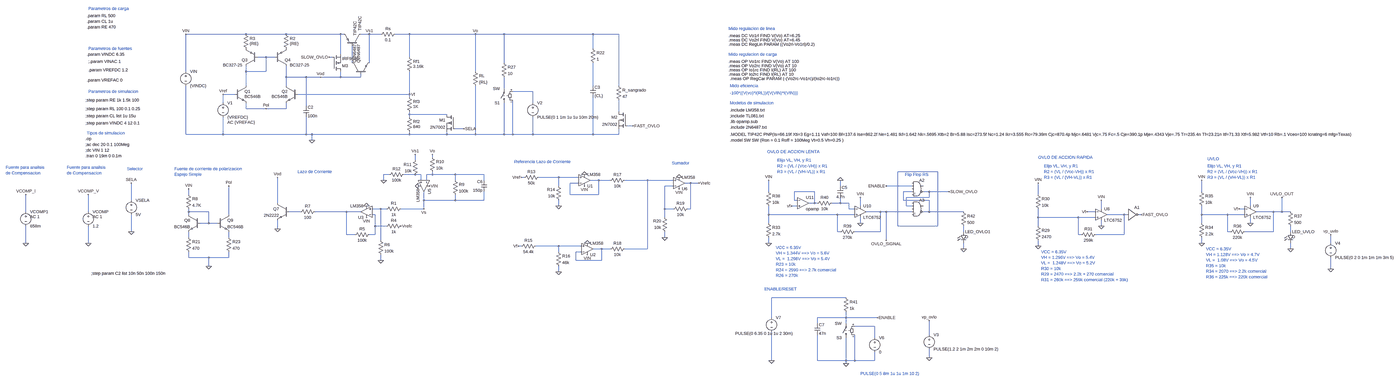
[diagram p0: schematic Regulador_LDOA_v8_uvlo_ovlo.asc, whole sheet]
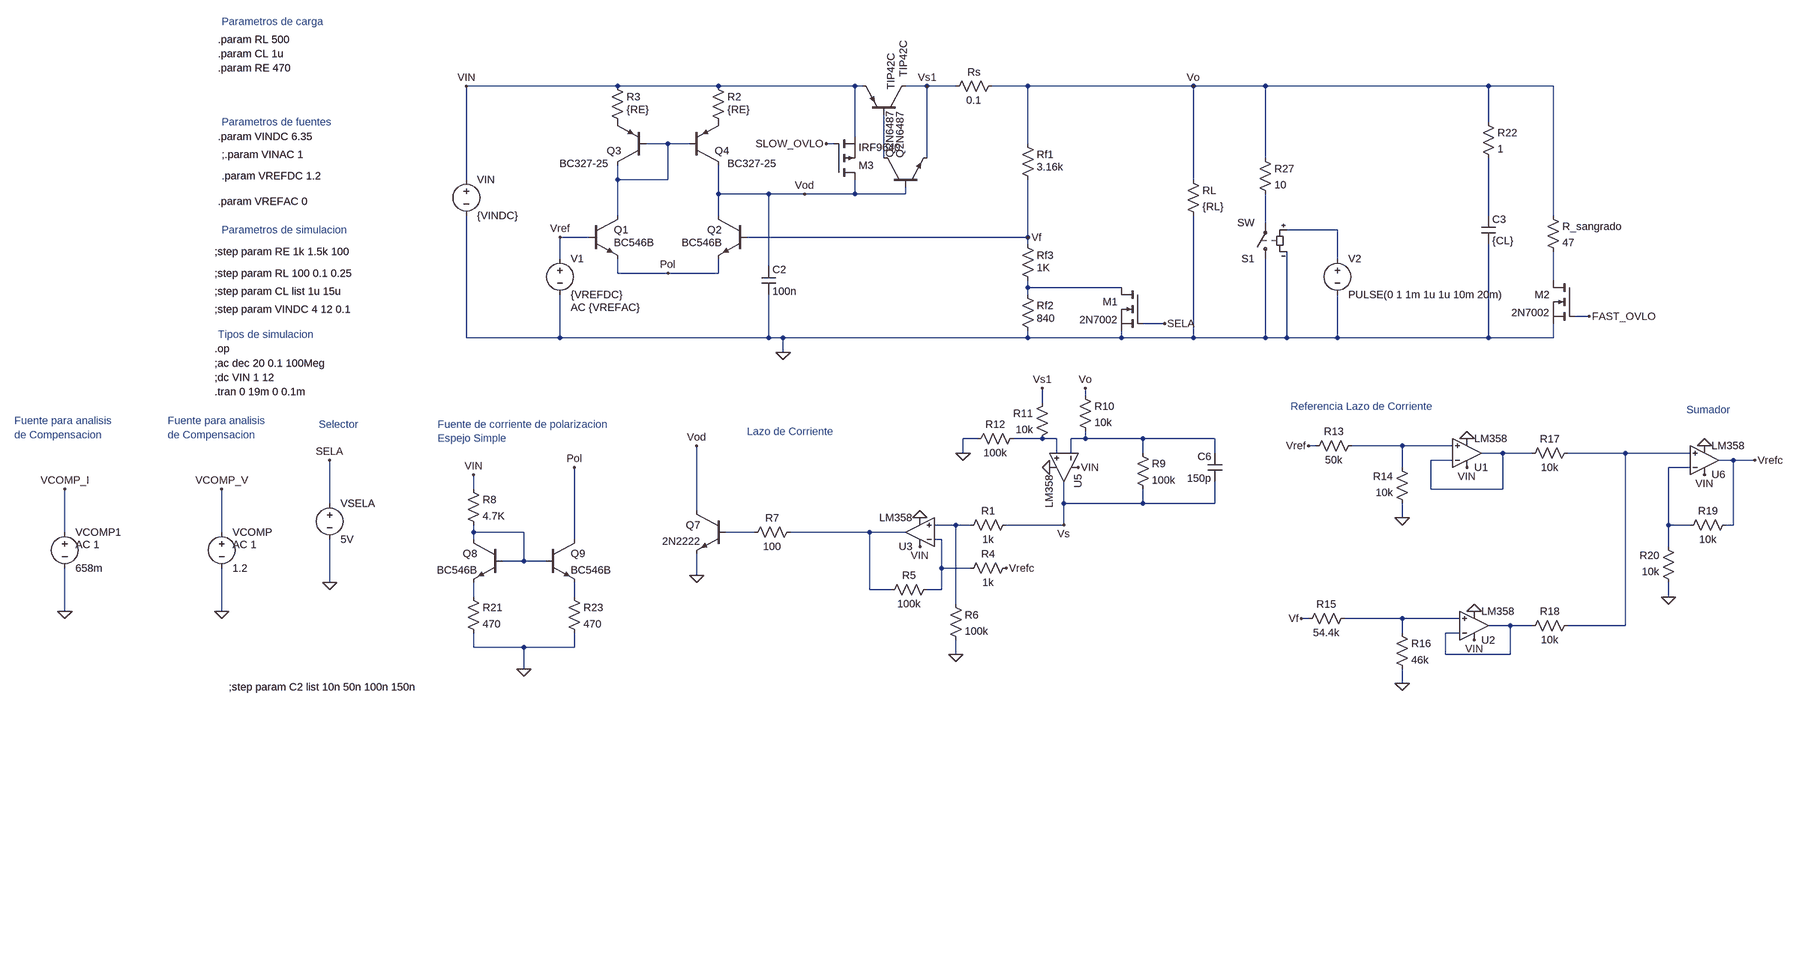
[diagram p1: schematic Regulador_LDOA_v8_uvlo_ovlo.asc, part, row 1 of 1, column 1 of 2]
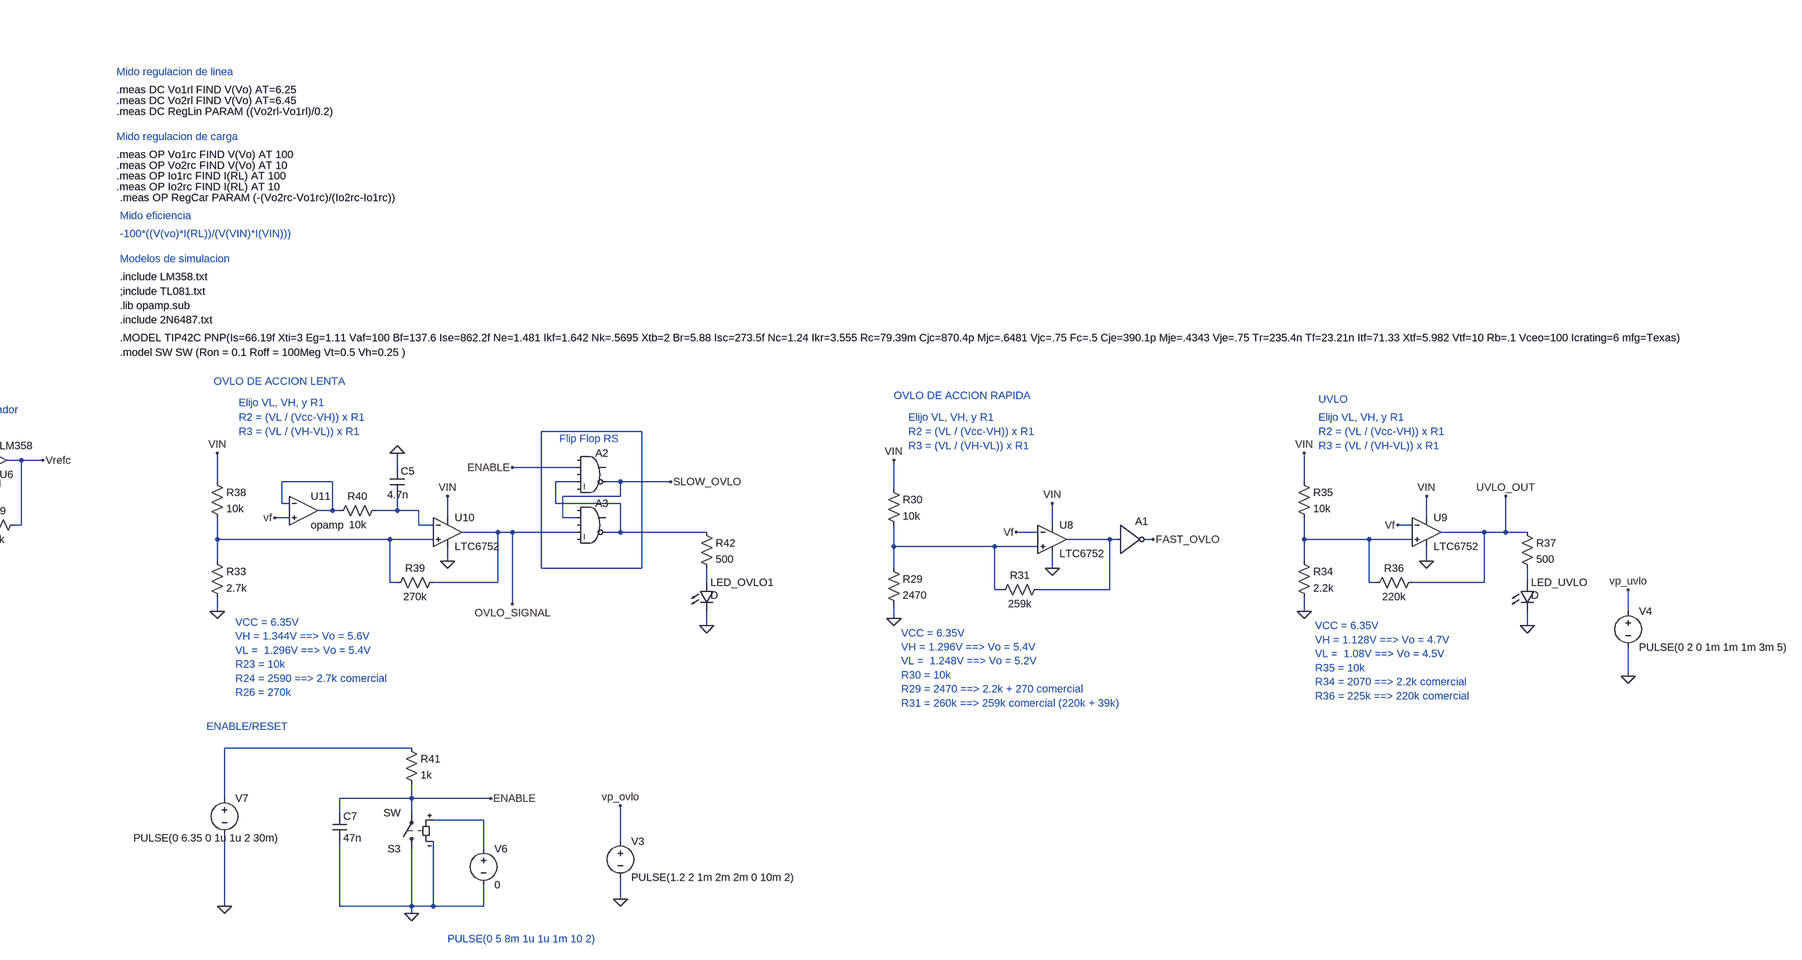
[diagram p2: schematic Regulador_LDOA_v8_uvlo_ovlo.asc, part, row 1 of 1, column 2 of 2]
Regulador_LDOA_v8_uvlo_ovlo.asc, the LTspice schematic file:
Version 4
SHEET 1 2316 856
WIRE -8688 -2384 -9024 -2384
WIRE -8464 -2384 -8688 -2384
WIRE -8160 -2384 -8464 -2384
WIRE -8144 -2384 -8160 -2384
WIRE -8000 -2384 -8048 -2384
WIRE -7936 -2384 -8000 -2384
WIRE -7776 -2384 -7856 -2384
WIRE -7408 -2384 -7776 -2384
WIRE -7248 -2384 -7408 -2384
WIRE -6752 -2384 -7248 -2384
WIRE -6608 -2384 -6752 -2384
WIRE -6752 -2304 -6752 -2384
WIRE -8160 -2272 -8160 -2384
WIRE -8576 -2256 -8624 -2256
WIRE -8528 -2256 -8576 -2256
WIRE -8208 -2256 -8224 -2256
WIRE -7776 -2256 -7776 -2384
WIRE -8096 -2224 -8096 -2320
WIRE -8000 -2224 -8000 -2384
WIRE -7248 -2224 -7248 -2384
WIRE -9024 -2176 -9024 -2384
WIRE -8688 -2176 -8688 -2208
WIRE -8576 -2176 -8576 -2256
WIRE -8576 -2176 -8688 -2176
WIRE -7408 -2176 -7408 -2384
WIRE -8464 -2144 -8464 -2208
WIRE -8352 -2144 -8464 -2144
WIRE -8272 -2144 -8352 -2144
WIRE -8160 -2144 -8160 -2176
WIRE -8160 -2144 -8272 -2144
WIRE -8048 -2144 -8048 -2160
WIRE -8048 -2144 -8160 -2144
WIRE -8688 -2096 -8688 -2176
WIRE -8464 -2096 -8464 -2144
WIRE -6752 -2096 -6752 -2224
WIRE -6608 -2096 -6608 -2384
WIRE -7248 -2080 -7248 -2144
WIRE -7088 -2064 -7200 -2064
WIRE -8752 -2048 -8816 -2048
WIRE -7776 -2048 -7776 -2176
WIRE -7776 -2048 -8400 -2048
WIRE -7776 -2032 -7776 -2048
WIRE -8816 -2000 -8816 -2048
WIRE -7088 -2000 -7088 -2064
WIRE -8352 -1984 -8352 -2144
WIRE -8688 -1968 -8688 -2000
WIRE -8576 -1968 -8688 -1968
WIRE -8464 -1968 -8464 -2000
WIRE -8464 -1968 -8576 -1968
WIRE -6608 -1952 -6608 -2016
WIRE -7776 -1936 -7776 -1952
WIRE -7568 -1936 -7776 -1936
WIRE -7776 -1920 -7776 -1936
WIRE -6528 -1872 -6560 -1872
WIRE -7472 -1856 -7520 -1856
WIRE -9024 -1824 -9024 -2096
WIRE -8816 -1824 -8816 -1920
WIRE -8816 -1824 -9024 -1824
WIRE -8352 -1824 -8352 -1920
WIRE -8352 -1824 -8816 -1824
WIRE -8320 -1824 -8352 -1824
WIRE -7776 -1824 -7776 -1840
WIRE -7776 -1824 -8320 -1824
WIRE -7568 -1824 -7568 -1840
WIRE -7568 -1824 -7776 -1824
WIRE -7408 -1824 -7408 -2096
WIRE -7408 -1824 -7568 -1824
WIRE -7248 -1824 -7248 -2000
WIRE -7248 -1824 -7408 -1824
WIRE -7200 -1824 -7200 -2016
WIRE -7200 -1824 -7248 -1824
WIRE -7088 -1824 -7088 -1920
WIRE -7088 -1824 -7200 -1824
WIRE -6752 -1824 -6752 -2032
WIRE -6752 -1824 -7088 -1824
WIRE -6608 -1824 -6608 -1856
WIRE -6608 -1824 -6752 -1824
WIRE -8320 -1792 -8320 -1824
WIRE -7648 -1696 -7648 -1712
WIRE -7744 -1680 -7744 -1712
WIRE -4800 -1616 -5024 -1616
WIRE -7888 -1600 -7920 -1600
WIRE -7744 -1600 -7808 -1600
WIRE -7712 -1600 -7744 -1600
WIRE -7648 -1600 -7648 -1616
WIRE -7648 -1600 -7680 -1600
WIRE -7520 -1600 -7648 -1600
WIRE -7360 -1600 -7520 -1600
WIRE -7136 -1584 -7152 -1584
WIRE -6944 -1584 -7056 -1584
WIRE -6832 -1584 -6944 -1584
WIRE -7920 -1568 -7920 -1600
WIRE -7712 -1568 -7712 -1600
WIRE -7680 -1568 -7680 -1600
WIRE -7520 -1568 -7520 -1600
WIRE -7360 -1568 -7360 -1600
WIRE -6720 -1568 -6768 -1568
WIRE -6656 -1568 -6720 -1568
WIRE -6448 -1568 -6576 -1568
WIRE -6304 -1568 -6448 -1568
WIRE -6832 -1552 -6880 -1552
WIRE -6208 -1552 -6240 -1552
WIRE -6160 -1552 -6208 -1552
WIRE -6944 -1536 -6944 -1584
WIRE -6304 -1536 -6352 -1536
WIRE -5344 -1536 -5344 -1568
WIRE -4944 -1536 -5088 -1536
WIRE -5744 -1504 -5744 -1568
WIRE -5488 -1504 -5600 -1504
WIRE -4944 -1504 -4992 -1504
WIRE -4848 -1504 -4880 -1504
WIRE -4736 -1504 -4848 -1504
WIRE -3328 -1504 -3328 -1568
WIRE -9008 -1488 -9008 -1520
WIRE -6880 -1488 -6880 -1552
WIRE -6720 -1488 -6720 -1568
WIRE -6720 -1488 -6880 -1488
WIRE -4240 -1488 -4240 -1552
WIRE -4848 -1472 -4848 -1504
WIRE -4848 -1472 -4976 -1472
WIRE -9328 -1456 -9328 -1552
WIRE -7696 -1456 -7696 -1504
WIRE -7520 -1456 -7520 -1488
WIRE -7520 -1456 -7696 -1456
WIRE -7360 -1456 -7360 -1504
WIRE -7360 -1456 -7520 -1456
WIRE -5600 -1456 -5600 -1504
WIRE -5584 -1456 -5600 -1456
WIRE -4992 -1456 -4992 -1504
WIRE -4848 -1456 -4992 -1456
WIRE -8512 -1440 -8512 -1584
WIRE -5488 -1440 -5488 -1504
WIRE -5488 -1440 -5520 -1440
WIRE -5472 -1440 -5488 -1440
WIRE -5344 -1440 -5344 -1472
WIRE -5344 -1440 -5392 -1440
WIRE -5296 -1440 -5344 -1440
WIRE -6944 -1424 -6944 -1456
WIRE -5584 -1424 -5616 -1424
WIRE -5232 -1424 -5232 -1472
WIRE -4976 -1424 -4976 -1472
WIRE -4944 -1424 -4976 -1424
WIRE -3056 -1424 -3056 -1472
WIRE -7936 -1408 -7984 -1408
WIRE -7904 -1408 -7936 -1408
WIRE -7696 -1408 -7696 -1456
WIRE -7696 -1408 -7824 -1408
WIRE -6352 -1408 -6352 -1536
WIRE -6304 -1408 -6352 -1408
WIRE -6208 -1408 -6208 -1552
WIRE -6208 -1408 -6224 -1408
WIRE -5296 -1408 -5296 -1440
WIRE -5264 -1408 -5296 -1408
WIRE -3888 -1408 -3888 -1456
WIRE -3088 -1408 -3120 -1408
WIRE -9920 -1392 -9920 -1488
WIRE -9568 -1392 -9568 -1488
WIRE -9008 -1392 -9008 -1408
WIRE -8896 -1392 -9008 -1392
WIRE -8384 -1392 -8448 -1392
WIRE -8128 -1392 -8304 -1392
WIRE -8048 -1392 -8128 -1392
WIRE -5120 -1392 -5200 -1392
WIRE -5088 -1392 -5120 -1392
WIRE -4944 -1392 -5088 -1392
WIRE -4848 -1392 -4848 -1456
WIRE -4848 -1392 -4880 -1392
WIRE -4656 -1392 -4848 -1392
WIRE -3920 -1392 -3968 -1392
WIRE -2928 -1392 -3024 -1392
WIRE -2880 -1392 -2880 -1472
WIRE -2880 -1392 -2928 -1392
WIRE -2832 -1392 -2880 -1392
WIRE -9008 -1376 -9008 -1392
WIRE -8784 -1376 -8784 -1536
WIRE -7968 -1376 -7984 -1376
WIRE -5744 -1376 -5744 -1424
WIRE -5360 -1376 -5744 -1376
WIRE -5264 -1376 -5360 -1376
WIRE -3760 -1376 -3856 -1376
WIRE -3744 -1376 -3760 -1376
WIRE -3664 -1376 -3680 -1376
WIRE -3328 -1376 -3328 -1424
WIRE -3184 -1376 -3328 -1376
WIRE -3088 -1376 -3184 -1376
WIRE -6352 -1360 -6352 -1408
WIRE -4240 -1360 -4240 -1408
WIRE -4016 -1360 -4240 -1360
WIRE -3920 -1360 -4016 -1360
WIRE -8896 -1328 -8896 -1392
WIRE -8896 -1328 -8944 -1328
WIRE -8848 -1328 -8896 -1328
WIRE -5744 -1328 -5744 -1376
WIRE -5232 -1328 -5232 -1360
WIRE -3328 -1328 -3328 -1376
WIRE -3056 -1328 -3056 -1360
WIRE -7968 -1312 -7968 -1376
WIRE -7904 -1312 -7968 -1312
WIRE -5024 -1312 -5024 -1616
WIRE -4800 -1312 -4800 -1616
WIRE -4800 -1312 -5024 -1312
WIRE -4240 -1312 -4240 -1360
WIRE -3888 -1312 -3888 -1344
WIRE -8512 -1296 -8512 -1344
WIRE -9328 -1280 -9328 -1376
WIRE -5360 -1280 -5360 -1376
WIRE -5344 -1280 -5360 -1280
WIRE -5120 -1280 -5120 -1392
WIRE -5120 -1280 -5264 -1280
WIRE -4656 -1280 -4656 -1312
WIRE -3184 -1280 -3184 -1376
WIRE -3168 -1280 -3184 -1280
WIRE -2928 -1280 -2928 -1392
WIRE -2928 -1280 -3088 -1280
WIRE -2832 -1280 -2832 -1312
WIRE -8128 -1264 -8128 -1392
WIRE -8080 -1264 -8128 -1264
WIRE -7968 -1264 -7968 -1312
WIRE -7968 -1264 -8000 -1264
WIRE -4016 -1264 -4016 -1360
WIRE -4000 -1264 -4016 -1264
WIRE -3760 -1264 -3760 -1376
WIRE -3760 -1264 -3920 -1264
WIRE -9008 -1248 -9008 -1280
WIRE -8784 -1248 -8784 -1280
WIRE -6352 -1248 -6352 -1280
WIRE -7936 -1232 -7936 -1408
WIRE -5088 -1232 -5088 -1392
WIRE -9920 -1216 -9920 -1312
WIRE -9568 -1216 -9568 -1312
WIRE -5744 -1216 -5744 -1248
WIRE -3328 -1216 -3328 -1248
WIRE -2608 -1216 -2608 -1264
WIRE -7152 -1200 -7168 -1200
WIRE -6944 -1200 -7072 -1200
WIRE -6816 -1200 -6944 -1200
WIRE -4240 -1200 -4240 -1232
WIRE -6704 -1184 -6752 -1184
WIRE -6656 -1184 -6704 -1184
WIRE -6448 -1184 -6448 -1568
WIRE -6448 -1184 -6576 -1184
WIRE -4656 -1184 -4656 -1216
WIRE -2832 -1184 -2832 -1216
WIRE -6944 -1168 -6944 -1200
WIRE -6816 -1168 -6848 -1168
WIRE -9008 -1136 -9008 -1168
WIRE -8896 -1136 -9008 -1136
WIRE -8784 -1136 -8784 -1168
WIRE -8784 -1136 -8896 -1136
WIRE -7936 -1120 -7936 -1152
WIRE -6848 -1120 -6848 -1168
WIRE -6704 -1120 -6704 -1184
WIRE -6704 -1120 -6848 -1120
WIRE -8896 -1088 -8896 -1136
WIRE -2608 -1072 -2608 -1136
WIRE -6944 -1056 -6944 -1088
WIRE -5312 -912 -5728 -912
WIRE -5728 -800 -5728 -912
WIRE -5312 -800 -5312 -832
WIRE -5312 -800 -5472 -800
WIRE -5136 -800 -5312 -800
WIRE -5472 -768 -5472 -800
WIRE -5312 -768 -5312 -800
WIRE -5152 -752 -5264 -752
WIRE -4848 -704 -4848 -784
WIRE -5152 -688 -5152 -752
WIRE -4848 -576 -4848 -624
WIRE -5728 -560 -5728 -720
WIRE -5472 -560 -5472 -704
WIRE -5312 -560 -5312 -688
WIRE -5312 -560 -5472 -560
WIRE -5264 -560 -5264 -704
WIRE -5264 -560 -5312 -560
WIRE -5152 -560 -5152 -608
WIRE -5152 -560 -5264 -560
WIRE -5312 -544 -5312 -560
FLAG -8320 -1792 0
FLAG -7408 -2384 Vo
FLAG -8816 -2048 Vref
FLAG -9024 -2384 VIN
FLAG -7776 -2048 Vf
FLAG -8000 -2384 Vs1
FLAG -7936 -1120 0
FLAG -8272 -2144 Vod
FLAG -7824 -1312 Vrefc
FLAG -7920 -1568 0
FLAG -6352 -1248 0
FLAG -6944 -1056 0
FLAG -6944 -1424 0
FLAG -7472 -1856 SELA
FLAG -9328 -1552 SELA
FLAG -9328 -1280 0
FLAG -6160 -1552 Vrefc
FLAG -7696 -1408 Vs
FLAG -8512 -1296 0
FLAG -8576 -1968 Pol
FLAG -8784 -1536 Pol
FLAG -9568 -1488 VCOMP_V
FLAG -9568 -1216 0
FLAG -8896 -1088 0
FLAG -7744 -1712 Vs1
FLAG -7648 -1712 Vo
FLAG -8512 -1584 Vod
FLAG -7152 -1584 Vref
FLAG -7168 -1200 Vf
FLAG -9920 -1488 VCOMP_I
FLAG -9920 -1216 0
FLAG -6272 -1584 0
FLAG -6272 -1520 VIN
FLAG -6800 -1600 0
FLAG -6800 -1536 VIN
FLAG -6784 -1216 0
FLAG -6784 -1152 VIN
FLAG -8016 -1424 0
FLAG -8016 -1360 VIN
FLAG -7728 -1536 0
FLAG -7664 -1536 VIN
FLAG -9008 -1520 VIN
FLAG -8224 -2256 SLOW_OVLO
FLAG -4240 -1552 VIN
FLAG -3968 -1392 Vf
FLAG -4240 -1200 0
FLAG -3888 -1312 0
FLAG -3888 -1456 VIN
FLAG -3664 -1376 FAST_OVLO
FLAG -3328 -1568 VIN
FLAG -3120 -1408 Vf
FLAG -3328 -1216 0
FLAG -3056 -1328 0
FLAG -3056 -1472 VIN
FLAG -2880 -1472 UVLO_OUT
FLAG -2832 -1184 0
FLAG -6528 -1872 FAST_OVLO
FLAG -2608 -1072 0
FLAG -2608 -1264 vp_uvlo
FLAG -5744 -1568 VIN
FLAG -5744 -1216 0
FLAG -5232 -1328 0
FLAG -5232 -1472 VIN
FLAG -5344 -1568 0
FLAG -5312 -544 0
FLAG -5728 -560 0
FLAG -5136 -800 ENABLE
FLAG -5616 -1424 vf
FLAG -5088 -1536 ENABLE
FLAG -4736 -1504 SLOW_OVLO
FLAG -4656 -1184 0
FLAG -5088 -1232 OVLO_SIGNAL
FLAG -4848 -576 0
FLAG -4848 -784 vp_ovlo
DATAFLAG -7536 -2384 ""
SYMBOL pnp -8624 -2208 R180
WINDOW 3 84 4 Left 2
SYMATTR Value BC327-25
SYMATTR InstName Q3
SYMBOL pnp -8528 -2208 M180
WINDOW 3 84 4 Left 2
SYMATTR Value BC327-25
SYMATTR InstName Q4
SYMBOL npn -8752 -2096 R0
WINDOW 3 56 60 Left 2
SYMATTR Value BC546B
SYMATTR InstName Q1
SYMBOL npn -8400 -2096 M0
WINDOW 3 56 60 Left 2
SYMATTR Value BC546B
SYMATTR InstName Q2
SYMBOL pnp -8048 -2320 M270
WINDOW 3 84 4 Left 2
SYMATTR Value TIP42C
SYMATTR InstName TIP42C
SYMBOL npn -8096 -2160 R270
WINDOW 3 65 14 Left 2
WINDOW 0 64 36 Left 2
SYMATTR Value Q2N6487
SYMATTR InstName Q2N6487
SYMBOL res -7792 -2272 R0
WINDOW 3 36 68 Left 2
SYMATTR Value 3.16k
SYMATTR InstName Rf1
SYMBOL res -7792 -1936 R0
WINDOW 3 36 68 Left 2
SYMATTR Value 840
SYMATTR InstName Rf2
SYMBOL res -7424 -2192 R0
SYMATTR InstName RL
SYMATTR Value {RL}
SYMBOL voltage -8816 -2016 R0
WINDOW 123 24 124 Left 2
WINDOW 39 0 0 Left 2
SYMATTR Value2 AC {VREFAC}
SYMATTR InstName V1
SYMATTR Value {VREFDC}
SYMBOL voltage -9024 -2192 R0
WINDOW 123 24 124 Left 2
WINDOW 39 0 0 Left 2
SYMATTR InstName VIN
SYMATTR Value {VINDC}
SYMBOL res -8704 -2400 R0
WINDOW 3 36 68 Left 2
SYMATTR Value {RE}
SYMATTR InstName R3
SYMBOL res -8480 -2400 R0
WINDOW 3 36 68 Left 2
SYMATTR Value {RE}
SYMATTR InstName R2
SYMBOL cap -6768 -2096 R0
SYMATTR InstName C3
SYMATTR Value {CL}
SYMBOL res -7840 -2400 R90
WINDOW 0 0 56 VBottom 2
WINDOW 3 32 56 VTop 2
SYMATTR InstName Rs
SYMATTR Value 0.1
SYMBOL res -7808 -1424 R90
WINDOW 0 0 56 VBottom 2
WINDOW 3 32 56 VTop 2
SYMATTR InstName R1
SYMATTR Value 1k
SYMBOL res -7808 -1328 R90
WINDOW 0 0 56 VBottom 2
WINDOW 3 32 56 VTop 2
SYMATTR InstName R4
SYMATTR Value 1k
SYMBOL res -7984 -1280 R90
WINDOW 0 0 56 VBottom 2
WINDOW 3 32 56 VTop 2
SYMATTR InstName R5
SYMATTR Value 100k
SYMBOL res -7952 -1248 R0
SYMATTR InstName R6
SYMATTR Value 100k
SYMBOL npn -8448 -1440 M0
SYMATTR InstName Q7
SYMATTR Value 2N2222
SYMBOL res -7536 -1584 R0
SYMATTR InstName R9
SYMATTR Value 100k
SYMBOL res -7664 -1712 R0
SYMATTR InstName R10
SYMATTR Value 10k
SYMBOL res -7728 -1696 M0
SYMATTR InstName R11
SYMATTR Value 10k
SYMBOL res -7792 -1616 R90
WINDOW 0 0 56 VBottom 2
WINDOW 3 32 56 VTop 2
SYMATTR InstName R12
SYMATTR Value 100k
SYMBOL res -7040 -1600 R90
WINDOW 0 0 56 VBottom 2
WINDOW 3 32 56 VTop 2
SYMATTR InstName R13
SYMATTR Value 50k
SYMBOL res -6928 -1440 R180
WINDOW 0 36 76 Left 2
WINDOW 3 36 40 Left 2
SYMATTR InstName R14
SYMATTR Value 10k
SYMBOL res -7168 -1184 R270
WINDOW 0 32 56 VTop 2
WINDOW 3 0 56 VBottom 2
SYMATTR InstName R15
SYMATTR Value 54.4k
SYMBOL res -6960 -1184 R0
SYMATTR InstName R16
SYMATTR Value 46k
SYMBOL res -6560 -1584 R90
WINDOW 0 0 56 VBottom 2
WINDOW 3 32 56 VTop 2
SYMATTR InstName R17
SYMATTR Value 10k
SYMBOL res -6560 -1200 R90
WINDOW 0 0 56 VBottom 2
WINDOW 3 32 56 VTop 2
SYMATTR InstName R18
SYMATTR Value 10k
SYMBOL res -6208 -1424 R90
WINDOW 0 0 56 VBottom 2
WINDOW 3 32 56 VTop 2
SYMATTR InstName R19
SYMATTR Value 10k
SYMBOL res -6336 -1264 R180
WINDOW 0 36 76 Left 2
WINDOW 3 36 40 Left 2
SYMATTR InstName R20
SYMATTR Value 10k
SYMBOL res -7792 -2048 R0
WINDOW 3 36 68 Left 2
SYMATTR Value 1K
SYMATTR InstName Rf3
SYMBOL nmos -7520 -1936 M0
SYMATTR InstName M1
SYMATTR Value 2N7002
SYMBOL voltage -9328 -1472 R0
WINDOW 123 0 0 Left 2
WINDOW 39 0 0 Left 2
SYMATTR InstName VSELA
SYMATTR Value 5V
SYMBOL res -8288 -1408 R90
WINDOW 0 0 56 VBottom 2
WINDOW 3 32 56 VTop 2
SYMATTR InstName R7
SYMATTR Value 100
SYMBOL npn -8944 -1376 M0
SYMATTR InstName Q8
SYMATTR Value BC546B
SYMBOL res -9024 -1504 R0
SYMATTR InstName R8
SYMATTR Value 4.7K
SYMBOL voltage -9568 -1408 R0
WINDOW 123 24 44 Left 2
WINDOW 39 0 0 Left 2
SYMATTR Value2 AC 1
SYMATTR InstName VCOMP
SYMATTR Value 1.2
SYMBOL npn -8848 -1376 R0
SYMATTR InstName Q9
SYMATTR Value BC546B
SYMBOL voltage -9920 -1408 R0
WINDOW 123 24 44 Left 2
WINDOW 39 0 0 Left 2
SYMATTR Value2 AC 1
SYMATTR InstName VCOMP1
SYMATTR Value 658m
SYMBOL cap -8368 -1984 R0
SYMATTR InstName C2
SYMATTR Value 100n
SYMBOL Opamps\\opamp2 -6272 -1488 M180
SYMATTR InstName U6
SYMATTR Value LM358
SYMBOL Opamps\\opamp2 -6800 -1504 M180
SYMATTR InstName U1
SYMATTR Value LM358
SYMBOL Opamps\\opamp2 -6784 -1120 M180
SYMATTR InstName U2
SYMATTR Value LM358
SYMBOL Opamps\\opamp2 -8016 -1328 R180
SYMATTR InstName U3
SYMATTR Value LM358
SYMBOL cap -7344 -1504 R180
WINDOW 0 24 56 Left 2
WINDOW 3 24 8 Left 2
SYMATTR InstName C6
SYMATTR Value 150p
SYMBOL Opamps\\opamp2 -7632 -1536 R90
SYMATTR InstName U5
SYMATTR Value LM358
SYMBOL res -6768 -2320 R0
SYMATTR InstName R22
SYMATTR Value 1
SYMBOL res -9024 -1264 R0
SYMATTR InstName R21
SYMATTR Value 470
SYMBOL res -8800 -1264 R0
SYMATTR InstName R23
SYMATTR Value 470
SYMBOL sw -7248 -1984 R180
SYMATTR InstName S1
SYMBOL res -7264 -2240 R0
SYMATTR InstName R27
SYMATTR Value 10
SYMBOL voltage -7088 -2016 R0
WINDOW 123 0 0 Left 0
WINDOW 39 0 0 Left 0
SYMATTR InstName V2
SYMATTR Value PULSE(0 1 1m 1u 1u 10m 20m)
SYMBOL pmos -8208 -2176 M180
SYMATTR InstName M3
SYMATTR Value IRF9640
SYMBOL res -4256 -1328 R0
SYMATTR InstName R29
SYMATTR Value 2470
SYMBOL res -4256 -1504 R0
SYMATTR InstName R30
SYMATTR Value 10k
SYMBOL res -3904 -1280 R90
WINDOW 0 0 56 VBottom 2
WINDOW 3 32 56 VTop 2
SYMATTR InstName R31
SYMATTR Value 259k
SYMBOL Comparators\\LTC6752 -3888 -1440 R0
SYMATTR InstName U8
SYMBOL res -3344 -1344 R0
SYMATTR InstName R34
SYMATTR Value 2.2k
SYMBOL res -3344 -1520 R0
SYMATTR InstName R35
SYMATTR Value 10k
SYMBOL res -3072 -1296 R90
WINDOW 0 0 56 VBottom 2
WINDOW 3 32 56 VTop 2
SYMATTR InstName R36
SYMATTR Value 220k
SYMBOL res -2848 -1408 R0
SYMATTR InstName R37
SYMATTR Value 500
SYMBOL Comparators\\LTC6752 -3056 -1456 R0
SYMATTR InstName U9
SYMBOL LED -2848 -1280 R0
WINDOW 3 24 28 Left 2
SYMATTR InstName LED_UVLO
SYMBOL res -6624 -2112 R0
SYMATTR InstName R_sangrado
SYMATTR Value 47
SYMBOL nmos -6560 -1952 M0
SYMATTR InstName M2
SYMATTR Value 2N7002
SYMBOL Digital\\inv -3744 -1440 R0
SYMATTR InstName A1
SYMATTR SpiceLine Vhigh = 6.35
SYMATTR SpiceLine2 Vlow = 0
SYMBOL voltage -2608 -1232 R0
SYMATTR InstName V4
SYMATTR Value PULSE(0 2 0 1m 1m 1m 3m 5)
SYMBOL res -5760 -1344 R0
SYMATTR InstName R33
SYMATTR Value 2.7k
SYMBOL res -5760 -1520 R0
SYMATTR InstName R38
SYMATTR Value 10k
SYMBOL res -5248 -1296 R90
WINDOW 0 0 56 VBottom 2
WINDOW 3 32 56 VTop 2
SYMATTR InstName R39
SYMATTR Value 270k
SYMBOL Comparators\\LTC6752 -5232 -1456 R0
SYMATTR InstName U10
SYMBOL cap -5360 -1536 R0
WINDOW 3 -6 61 Left 2
SYMATTR Value 4.7n
SYMATTR InstName C5
SYMBOL res -5376 -1456 R90
WINDOW 0 0 56 VBottom 2
WINDOW 3 32 56 VTop 2
SYMATTR InstName R40
SYMATTR Value 10k
SYMBOL sw -5312 -672 R180
SYMATTR InstName S3
SYMBOL res -5328 -928 R0
SYMATTR InstName R41
SYMATTR Value 1k
SYMBOL voltage -5152 -704 R0
WINDOW 123 0 0 Left 0
WINDOW 39 0 0 Left 0
SYMATTR InstName V6
SYMATTR Value 0
SYMBOL cap -5488 -768 R0
SYMATTR InstName C7
SYMATTR Value 47n
SYMBOL voltage -5728 -816 R0
WINDOW 3 -202 104 Left 2
WINDOW 123 0 0 Left 0
WINDOW 39 0 0 Left 0
SYMATTR Value PULSE(0 6.35 0 1u 1u 2 30m)
SYMATTR InstName V7
SYMBOL OpAmps\\opamp -5552 -1504 R0
SYMATTR InstName U11
SYMBOL Digital\\and -4912 -1584 R0
SYMATTR InstName A2
SYMATTR SpiceLine Vhigh = 5
SYMATTR SpiceLine2 Vlow = 0
SYMBOL Digital\\and -4912 -1472 R0
SYMATTR InstName A3
SYMATTR SpiceLine Vhigh = 5
SYMATTR SpiceLine2 Vlow = 0
SYMBOL res -4672 -1408 R0
SYMATTR InstName R42
SYMATTR Value 500
SYMBOL LED -4672 -1280 R0
WINDOW 3 24 28 Left 2
SYMATTR InstName LED_OVLO1
SYMBOL voltage -4848 -720 R0
WINDOW 123 0 0 Left 0
WINDOW 39 0 0 Left 0
SYMATTR InstName V3
SYMATTR Value PULSE(1.2 2 1m 2m 2m 0 10m 2)
TEXT -9584 -1800 Left 2 !.op
TEXT -9584 -1768 Left 2 !;ac dec 20 0.1 100Meg
TEXT -9576 -2272 Left 2 !.param VINDC 6.35
TEXT -9568 -2232 Left 2 !;.param VINAC 1
TEXT -9568 -2184 Left 2 !.param VREFDC 1.2
TEXT -9576 -2128 Left 2 !.param VREFAC 0
TEXT -9576 -2488 Left 2 !.param RL 500
TEXT -9584 -1736 Left 2 !;dc VIN 1 12
TEXT -9584 -2016 Left 2 !;step param RE 1k 1.5k 100
TEXT -9576 -2424 Left 2 !.param RE 470
TEXT -9584 -1968 Left 2 !;step param RL 100 0.1 0.25
TEXT -5968 -2416 Left 2 ;Mido regulacion de linea
TEXT -5968 -2376 Left 2 !.meas DC Vo1rl FIND V(Vo) AT=6.25
TEXT -5968 -2352 Left 2 !.meas DC Vo2rl FIND V(Vo) AT=6.45
TEXT -5968 -2328 Left 2 !.meas DC RegLin PARAM ((Vo2rl-Vo1rl)/0.2)
TEXT -5968 -2272 Left 2 ;Mido regulacion de carga
TEXT -5968 -2232 Left 2 !.meas OP Vo1rc FIND V(Vo) AT 100
TEXT -5968 -2208 Left 2 !.meas OP Vo2rc FIND V(Vo) AT 10
TEXT -5968 -2184 Left 2 !.meas OP Io1rc FIND I(RL) AT 100
TEXT -5968 -2160 Left 2 !.meas OP Io2rc FIND I(RL) AT 10
TEXT -5960 -2096 Left 2 ;Mido eficiencia
TEXT -5960 -2056 Left 2 ;-100*((V(vo)*I(RL))/(V(VIN)*I(VIN)))
TEXT -5960 -2136 Left 2 !.meas OP RegCar PARAM (-(Vo2rc-Vo1rc)/(Io2rc-Io1rc))
TEXT -9584 -1704 Left 2 !.tran 0 19m 0 0.1m
TEXT -8400 -1616 Left 2 ;Lazo de Corriente
TEXT -5960 -1928 Left 2 !;include TL081.txt
TEXT -7192 -1672 Left 2 ;Referencia Lazo de Corriente
TEXT -9584 -1888 Left 2 !;step param VINDC 4 12 0.1
TEXT -6312 -1664 Left 2 ;Sumador
TEXT -9352 -1632 Left 2 ;Selector
TEXT -5960 -1896 Left 2 !.lib opamp.sub
TEXT -9088 -1632 Left 2 ;Fuente de corriente de polarizacion\nEspejo Simple
TEXT -9688 -1640 Left 2 ;Fuente para analisis \nde Compensacion
TEXT -9576 -2456 Left 2 !.param CL 1u
TEXT -9568 -2528 Left 2 ;Parametros de carga
TEXT -9568 -2304 Left 2 ;Parametros de fuentes
TEXT -9568 -2064 Left 2 ;Parametros de simulacion
TEXT -5960 -2000 Left 2 ;Modelos de simulacion
TEXT -9576 -1832 Left 2 ;Tipos de simulacion
TEXT -9584 -1928 Left 2 !;step param CL list 1u 15u
TEXT -9552 -1048 Left 2 !;step param C2 list 10n 50n 100n 150n
TEXT -10032 -1640 Left 2 ;Fuente para analisis \nde Compensacion
TEXT -5960 -1824 Left 2 !.MODEL TIP42C PNP(Is=66.19f Xti=3 Eg=1.11 Vaf=100 Bf=137.6 Ise=862.2f Ne=1.481 Ikf=1.642 Nk=.5695 Xtb=2 Br=5.88 Isc=273.5f Nc=1.24 Ikr=3.555 Rc=79.39m Cjc=870.4p Mjc=.6481 Vjc=.75 Fc=.5 Cje=390.1p Mje=.4343 Vje=.75 Tr=235.4n Tf=23.21n Itf=71.33 Xtf=5.982 Vtf=10 Rb=.1 Vceo=100 Icrating=6 mfg=Texas)
TEXT -5960 -1864 Left 2 !.include 2N6487.txt
TEXT -5960 -1960 Left 2 !.include LM358.txt
TEXT -5960 -1792 Left 2 !.model SW SW (Ron = 0.1 Roff = 100Meg Vt=0.5 Vh=0.25 )
TEXT -4240 -1696 Left 2 ;OVLO DE ACCION RAPIDA
TEXT -3296 -1688 Left 2 ;UVLO
TEXT -4208 -1648 Left 2 ;Elijo VL, VH, y R1
TEXT -4208 -1616 Left 2 ;R2 = (VL / (Vcc-VH)) x R1
TEXT -4208 -1584 Left 2 ;R3 = (VL / (VH-VL)) x R1
TEXT -3296 -1648 Left 2 ;Elijo VL, VH, y R1
TEXT -3296 -1616 Left 2 ;R2 = (VL / (Vcc-VH)) x R1
TEXT -3296 -1584 Left 2 ;R3 = (VL / (VH-VL)) x R1
TEXT -4224 -1168 Left 2 ;VCC = 6.35V\nVH = 1.296V ==> Vo = 5.4V\nVL =  1.248V ==> Vo = 5.2V\nR30 = 10k\nR29 = 2470 ==> 2.2k + 270 comercial\nR31 = 260k ==> 259k comercial (220k + 39k)
TEXT -3304 -1184 Left 2 ;VCC = 6.35V\nVH = 1.128V ==> Vo = 4.7V\nVL =  1.08V ==> Vo = 4.5V\nR35 = 10k\nR34 = 2070 ==> 2.2k comercial\nR36 = 225k ==> 220k comercial
TEXT -5768 -960 Left 2 ;ENABLE/RESET
TEXT -5752 -1728 Left 2 ;OVLO DE ACCION LENTA
TEXT -5696 -1680 Left 2 ;Elijo VL, VH, y R1
TEXT -5696 -1648 Left 2 ;R2 = (VL / (Vcc-VH)) x R1
TEXT -5696 -1616 Left 2 ;R3 = (VL / (VH-VL)) x R1
TEXT -5704 -1192 Left 2 ;VCC = 6.35V\nVH = 1.344V ==> Vo = 5.6V\nVL =  1.296V ==> Vo = 5.4V\nR23 = 10k\nR24 = 2590 ==> 2.7k comercial\nR26 = 270k
TEXT -5232 -488 Left 2 ;PULSE(0 5 8m 1u 1u 1m 10 2)
TEXT -4984 -1600 Left 2 ;Flip Flop RS

The netlist it stands for:
* Regulador_LDOA_v8_uvlo_ovlo.asc
Q3 N001 N001 P001 0 BC327-25
Q4 Vod N001 P002 0 BC327-25
Q1 N001 Vref Pol 0 BC546B
Q2 Vod Vf Pol 0 BC546B
Q§TIP42C Vs1 N002 VIN 0 TIP42C
Q2N6487 N002 Vod Vs1 0 Q2N6487
Rf1 Vo Vf 3.16k
Rf2 N007 0 840
RL Vo 0 {RL}
V1 Vref 0 {VREFDC} AC {VREFAC}
VIN VIN 0 {VINDC}
R3 VIN P001 {RE}
R2 VIN P002 {RE}
C3 N003 0 {CL}
Rs Vo Vs1 0.1
R1 Vs N018 1k
R4 Vrefc N022 1k
R5 N022 N021 100k
R6 N018 0 100k
Q7 Vod N020 0 0 2N2222
R9 N010 Vs 100k
R10 Vo N010 10k
R11 Vs1 N009 10k
R12 N009 0 100k
R13 N011 Vref 50k
R14 0 N011 10k
R15 Vf N031 54.4k
R16 N031 0 46k
R17 N013 N012 10k
R18 N013 N032 10k
R19 Vrefc N014 10k
R20 0 N014 10k
Rf3 Vf N007 1K
M1 N007 SELA 0 0 2N7002
VSELA SELA 0 5V
R7 N021 N020 100
Q8 N019 N019 N029 0 BC546B
R8 VIN N019 4.7K
VCOMP VCOMP_V 0 1.2 AC 1
Q9 Pol N019 N030 0 BC546B
VCOMP1 VCOMP_I 0 658m AC 1
C2 Vod 0 100n
XU6 N013 N014 VIN 0 Vrefc LM358  ; pins In+ In- V+ V- OUT
XU1 N011 N012 VIN 0 N012 LM358  ; pins In+ In- V+ V- OUT
XU2 N031 N032 VIN 0 N032 LM358  ; pins In+ In- V+ V- OUT
XU3 N018 N022 VIN 0 N021 LM358  ; pins In+ In- V+ V- OUT
C6 Vs N010 150p
XU5 N009 N010 VIN 0 Vs LM358  ; pins In+ In- V+ V- OUT
R22 Vo N003 1
R21 N029 0 470
R23 N030 0 470
S1 0 N004 N005 0 SW
R27 Vo N004 10
V2 N005 0 PULSE(0 1 1m 1u 1u 10m 20m)
M3 Vod SLOW_OVLO VIN VIN IRF9640
R29 N026 0 2470
R30 VIN N026 10k
R31 N024 N026 259k
XU8 N026 Vf VIN 0 N024 LTC6752  ; pins In+ In- V+ V- OUT
R34 N025 0 2.2k
R35 VIN N025 10k
R36 UVLO_OUT N025 220k
R37 UVLO_OUT N028 500
XU9 N025 Vf VIN 0 UVLO_OUT LTC6752  ; pins In+ In- V+ V- OUT
D§LED_UVLO N028 0 D
R_sangrado Vo N006 47
M2 N006 FAST_OVLO 0 0 2N7002
A1 N024 0 0 0 0 FAST_OVLO 0 0 BUF Vhigh = 6.35 Vlow = 0
V4 vp_uvlo 0 PULSE(0 2 0 1m 1m 1m 3m 5)
R33 N023 0 2.7k
R38 VIN N023 10k
R39 OVLO_SIGNAL N023 270k
XU10 N023 N017 VIN 0 OVLO_SIGNAL LTC6752  ; pins In+ In- V+ V- OUT
C5 0 N017 4.7n
R40 N017 N015 10k
S3 0 ENABLE N034 0 SW
R41 N033 ENABLE 1k
V6 N034 0 0
C7 ENABLE 0 47n
V7 N033 0 PULSE(0 6.35 0 1u 1u 2 30m)
XU11 N015 Vf N015 opamp Aol=100K GBW=10Meg  ; pins invin noninvin out
A2 0 ENABLE 0 N016 0 SLOW_OVLO 0 0 AND Vhigh = 5 Vlow = 0
A3 0 SLOW_OVLO 0 OVLO_SIGNAL 0 N016 0 0 AND Vhigh = 5 Vlow = 0
R42 N016 N027 500
D§LED_OVLO1 N027 0 D
V3 vp_ovlo 0 PULSE(1.2 2 1m 2m 2m 0 10m 2)
.model D D
.lib standard.dio
.model NPN NPN
.model PNP PNP
.lib standard.bjt
.model NMOS NMOS
.model PMOS PMOS
.lib standard.mos
.op
;ac dec 20 0.1 100Meg
.param VINDC 6.35
;.param VINAC 1
.param VREFDC 1.2
.param VREFAC 0
.param RL 500
;dc VIN 1 12
;step param RE 1k 1.5k 100
.param RE 470
;step param RL 100 0.1 0.25
* Mido regulacion de linea
.meas DC Vo1rl FIND V(Vo) AT=6.25
.meas DC Vo2rl FIND V(Vo) AT=6.45
.meas DC RegLin PARAM ((Vo2rl-Vo1rl)/0.2)
* Mido regulacion de carga
.meas OP Vo1rc FIND V(Vo) AT 100
.meas OP Vo2rc FIND V(Vo) AT 10
.meas OP Io1rc FIND I(RL) AT 100
.meas OP Io2rc FIND I(RL) AT 10
* Mido eficiencia
* -100*((V(vo)*I(RL))/(V(VIN)*I(VIN)))
.meas OP RegCar PARAM (-(Vo2rc-Vo1rc)/(Io2rc-Io1rc))
.tran 0 19m 0 0.1m
* Lazo de Corriente
;include TL081.txt
* Referencia Lazo de Corriente
;step param VINDC 4 12 0.1
* Sumador
* Selector
.lib opamp.sub
* Fuente de corriente de polarizacion
* Espejo Simple
* Fuente para analisis
* de Compensacion
.param CL 1u
* Parametros de carga
* Parametros de fuentes
* Parametros de simulacion
* Modelos de simulacion
* Tipos de simulacion
;step param CL list 1u 15u
;step param C2 list 10n 50n 100n 150n
* Fuente para analisis
* de Compensacion
.MODEL TIP42C PNP(Is=66.19f Xti=3 Eg=1.11 Vaf=100 Bf=137.6 Ise=862.2f Ne=1.481 Ikf=1.642 Nk=.5695 Xtb=2 Br=5.88 Isc=273.5f Nc=1.24 Ikr=3.555 Rc=79.39m Cjc=870.4p Mjc=.6481 Vjc=.75 Fc=.5 Cje=390.1p Mje=.4343 Vje=.75 Tr=235.4n Tf=23.21n Itf=71.33 Xtf=5.982 Vtf=10 Rb=.1 Vceo=100 Icrating=6 mfg=Texas)
.include 2N6487.txt
.include LM358.txt
.model SW SW (Ron = 0.1 Roff = 100Meg Vt=0.5 Vh=0.25 )
* OVLO DE ACCION RAPIDA
* UVLO
* Elijo VL, VH, y R1
* R2 = (VL / (Vcc-VH)) x R1
* R3 = (VL / (VH-VL)) x R1
* Elijo VL, VH, y R1
* R2 = (VL / (Vcc-VH)) x R1
* R3 = (VL / (VH-VL)) x R1
* VCC = 6.35V
* VH = 1.296V ==> Vo = 5.4V
* VL =  1.248V ==> Vo = 5.2V
* R30 = 10k
* R29 = 2470 ==> 2.2k + 270 comercial
* R31 = 260k ==> 259k comercial (220k + 39k)
* VCC = 6.35V
* VH = 1.128V ==> Vo = 4.7V
* VL =  1.08V ==> Vo = 4.5V
* R35 = 10k
* R34 = 2070 ==> 2.2k comercial
* R36 = 225k ==> 220k comercial
* ENABLE/RESET
* OVLO DE ACCION LENTA
* Elijo VL, VH, y R1
* R2 = (VL / (Vcc-VH)) x R1
* R3 = (VL / (VH-VL)) x R1
* VCC = 6.35V
* VH = 1.344V ==> Vo = 5.6V
* VL =  1.296V ==> Vo = 5.4V
* R23 = 10k
* R24 = 2590 ==> 2.7k comercial
* R26 = 270k
* PULSE(0 5 8m 1u 1u 1m 10 2)
* Flip Flop RS
.lib LTC7.lib
.backanno
.end